# EAGLE schematic XT60 (EAGLE 9.6.2)
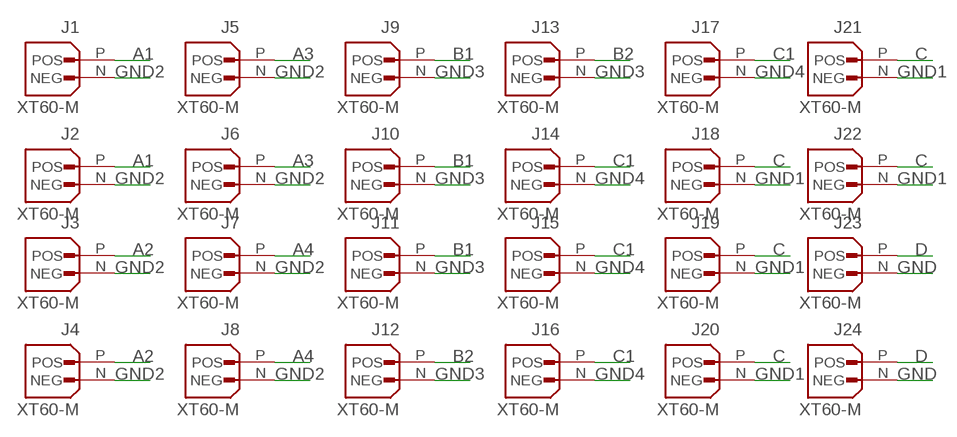
[diagram p0: schematic, sheet 1]

## Parts
J1  XT60-M  [AMASS_XT60-M]
J2  XT60-M  [AMASS_XT60-M]
J3  XT60-M  [AMASS_XT60-M]
J4  XT60-M  [AMASS_XT60-M]
J5  XT60-M  [AMASS_XT60-M]
J6  XT60-M  [AMASS_XT60-M]
J7  XT60-M  [AMASS_XT60-M]
J8  XT60-M  [AMASS_XT60-M]
J9  XT60-M  [AMASS_XT60-M]
J10  XT60-M  [AMASS_XT60-M]
J11  XT60-M  [AMASS_XT60-M]
J12  XT60-M  [AMASS_XT60-M]
J13  XT60-M  [AMASS_XT60-M]
J14  XT60-M  [AMASS_XT60-M]
J15  XT60-M  [AMASS_XT60-M]
J16  XT60-M  [AMASS_XT60-M]
J17  XT60-M  [AMASS_XT60-M]
J18  XT60-M  [AMASS_XT60-M]
J19  XT60-M  [AMASS_XT60-M]
J20  XT60-M  [AMASS_XT60-M]
J21  XT60-M  [AMASS_XT60-M]
J22  XT60-M  [AMASS_XT60-M]
J23  XT60-M  [AMASS_XT60-M]
J24  XT60-M  [AMASS_XT60-M]

## Nets
A1 [power]: J1.P(POS) J2.P(POS)
A2 [power]: J3.P(POS) J4.P(POS)
A3 [power]: J5.P(POS) J6.P(POS)
A4 [power]: J7.P(POS) J8.P(POS)
B1 [power]: J9.P(POS) J10.P(POS) J11.P(POS)
B2 [power]: J12.P(POS) J13.P(POS)
C [power]: J18.P(POS) J19.P(POS) J20.P(POS) J21.P(POS) J22.P(POS)
C1 [power]: J14.P(POS) J15.P(POS) J16.P(POS) J17.P(POS)
D [power]: J23.P(POS) J24.P(POS)
GND: J23.N(NEG) J24.N(NEG)
GND1: J18.N(NEG) J19.N(NEG) J20.N(NEG) J21.N(NEG) J22.N(NEG)
GND2: J1.N(NEG) J2.N(NEG) J3.N(NEG) J4.N(NEG) J5.N(NEG) J6.N(NEG) J7.N(NEG) J8.N(NEG)
GND3: J9.N(NEG) J10.N(NEG) J11.N(NEG) J12.N(NEG) J13.N(NEG)
GND4: J14.N(NEG) J15.N(NEG) J16.N(NEG) J17.N(NEG)

## Library data of the parts
J1-J24 = XT60-M:XT60-M: Check availability <https://pricing.snapeda.com/parts/XT60-M/AMASS/view-part?ref=eda>; AVAILABILITY: Not in stock; DESCRIPTION: Plug; DC supply; XT60; male; PIN: 2; for cable; soldered; 30A; 500V; MF: AMASS; MP: XT60-M; PACKAGE: Package; PRICE: None

## Net classes
0 default: width 1 mm, drill 0.762 mm, clearance 0.3 mm
1 power: width 2 mm, drill 0.762 mm, clearance 0.3 mm